# Altium project SuperCap_V1.1.PrjPcb
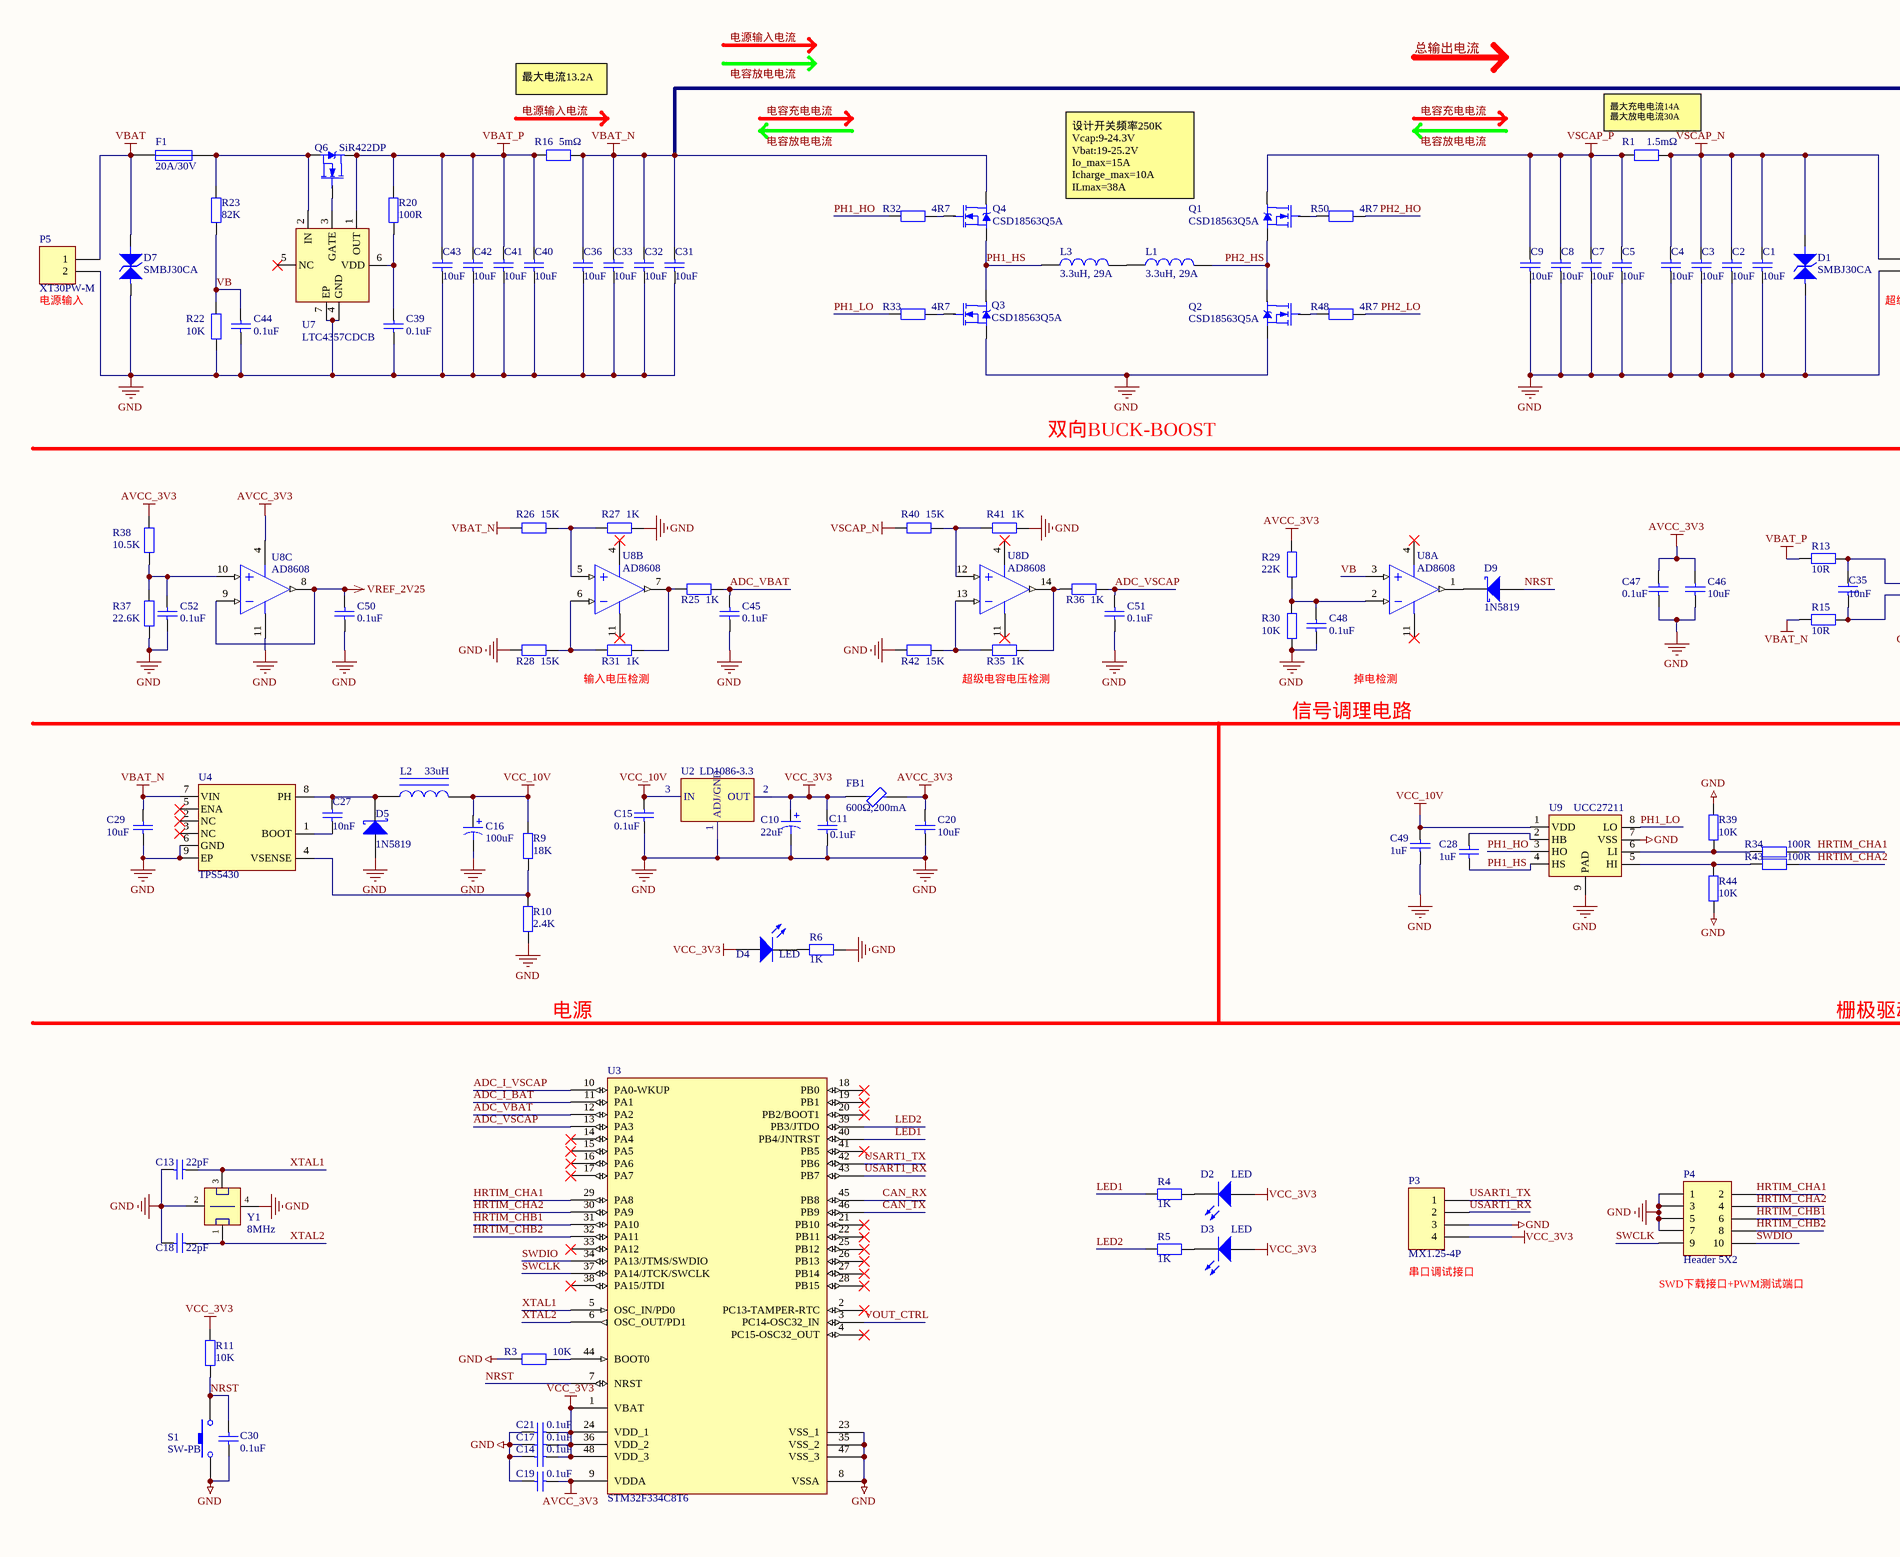
[diagram p0: SuperCap.SchDoc, left]
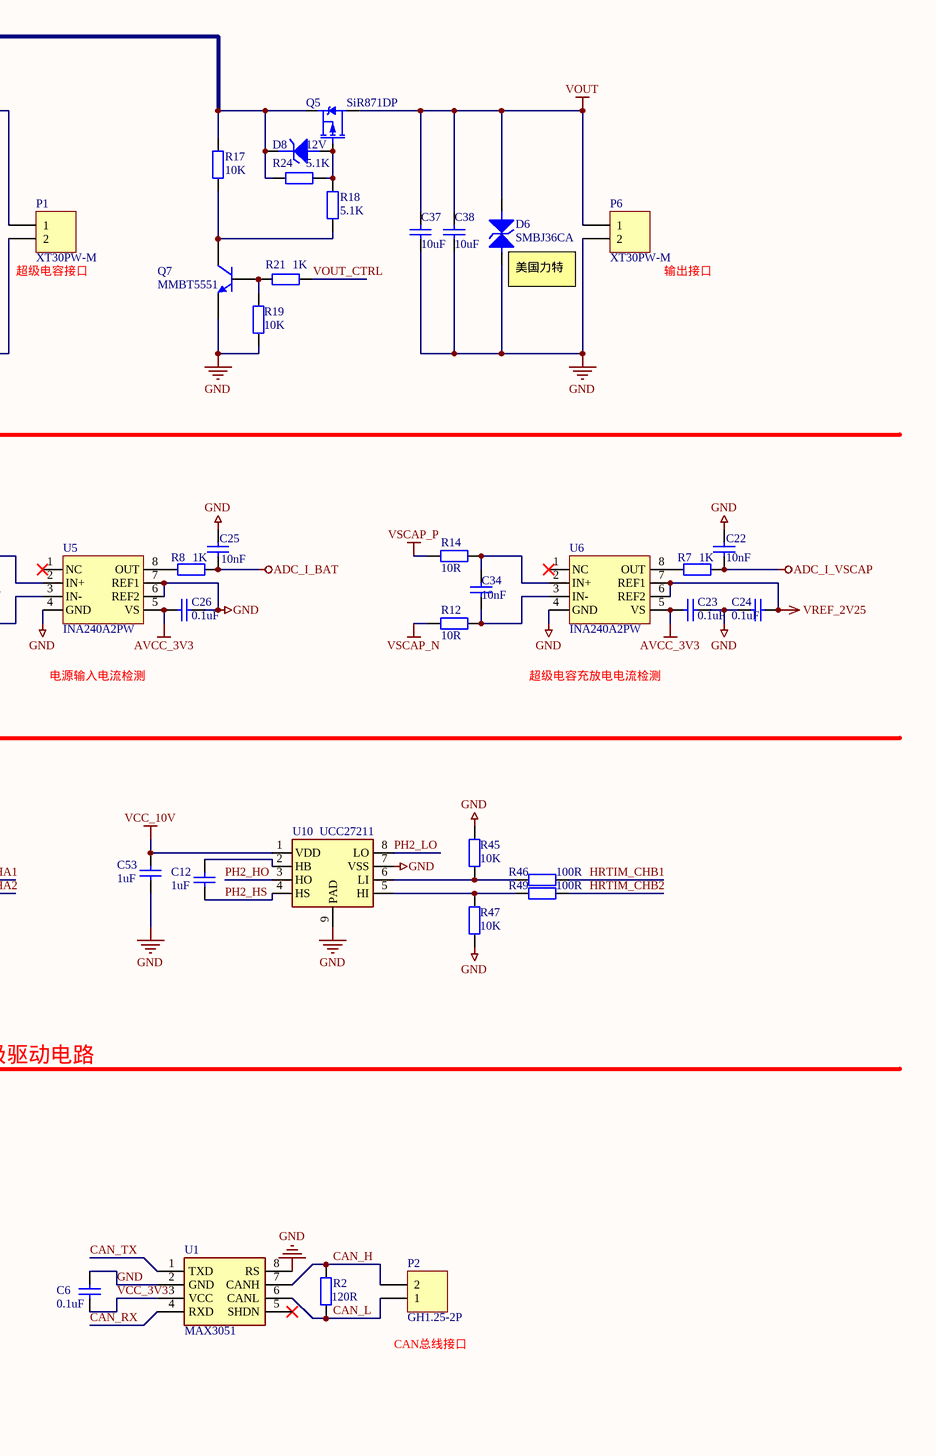
[diagram p1: SuperCap.SchDoc, right]
1 sheet, 142 parts. Net scope: global (net labels, ports and power ports of the same name join across sheets).
Board file: SuperCap.PcbDoc

## Sheet SuperCap.SchDoc
size A2

### Parts
C1  10uF  [C 0805_M]
C2  10uF  [C 0805_M]
C3  10uF  [C 0805_M]
C4  10uF  [C 0805_M]
C5  10uF  [C 0805_M]
C6  0.1uF  [C 0603_M]
C7  10uF  [C 0805_M]
C8  10uF  [C 0805_M]
C9  10uF  [C 0805_M]
C10  22uF  [CD B(3528)]
C11  0.1uF  [C 0603_M]
C12  1uF  [C 0603_M]
C13  22pF  [C 0603_M]
C14  0.1uF  [C 0603_M]
C15  0.1uF  [C 0603_M]
C16  100uF  [CD C(6032)]
C17  0.1uF  [C 0603_M]
C18  22pF  [C 0603_M]
C19  0.1uF  [C 0603_M]
C20  10uF  [C 0603_M]
C21  0.1uF  [C 0603_M]
C22  10nF  [C 0603_M]
C23  0.1uF  [C 0603_M]
C24  0.1uF  [C 0603_M]
C25  10nF  [C 0603_M]
C26  0.1uF  [C 0603_M]
C27  10nF  [C 0603_M]
C28  1uF  [C 0603_M]
C29  10uF  [C 0805_M]
C30  0.1uF  [C 0603_M]
C31  10uF  [C 0805_M]
C32  10uF  [C 0805_M]
C33  10uF  [C 0805_M]
C34  10nF  [C 0603_M]
C35  10nF  [C 0603_M]
C36  10uF  [C 0805_M]
C37  10uF  [C 0805_M]
C38  10uF  [C 0805_M]
C39  0.1uF  [C 0603_M]
C40  10uF  [C 0805_M]
C41  10uF  [C 0805_M]
C42  10uF  [C 0805_M]
C43  10uF  [C 0805_M]
C44  0.1uF  [C 0603_M]
C45  0.1uF  [C 0603_M]
C46  10uF  [C 0603_M]
C47  0.1uF  [C 0603_M]
C48  0.1uF  [C 0603_M]
C49  1uF  [C 0603_M]
C50  0.1uF  [C 0603_M]
C51  0.1uF  [C 0603_M]
C52  0.1uF  [C 0603_M]
C53  1uF  [C 0603_M]
D1  SMBJ30CA  [SMB]
D2  LED  [LED 0603R]
D3  LED  [LED 0603R]
D4  LED  [LED 0603R]
D5  1N5819  [SMA]
D6  SMBJ36CA  [SMB]
D7  SMBJ30CA  [SMB]
D8  12V  [SOD-123]
D9  1N5819  [SOD-323]
F1  20A/30V  [FU 1206]
FB1  600Ω,200mA  [FB0603_M]
L1  3.3uH, 29A  [WE-HCI_2212]
L2  33uH  [L-SMD-0630]
L3  3.3uH, 29A  [WE-HCI_2212]
P1  XT30PW-M  [XT30PW-M]
P2  GH1.25-2P  [A1257WR-S-2P]
P3  MX1.25-4P  [MX 1.25-WS-4P]
P4  Header 5X2  [HDR2.54-LI-2x5P]
P5  XT30PW-M  [XT30PW-M]
P6  XT30PW-M  [XT30PW-M]
Q1  CSD18563Q5A  [PG-TDSON-8]
Q2  CSD18563Q5A  [PG-TDSON-8]
Q3  CSD18563Q5A  [PG-TDSON-8]
Q4  CSD18563Q5A  [PG-TDSON-8]
Q5  SiR871DP  [PG-TDSON-8]
Q6  SiR422DP  [PG-TDSON-8]
Q7  MMBT5551  [SOT23-3N]
R1  1.5mΩ  [R 2512_M]
R2  120R  [R 0603_M]
R3  10K  [R 0603_M]
R4  1K  [R 0603_M]
R5  1K  [R 0603_M]
R6  1K  [R 0603_M]
R7  1K  [R 0603_M]
R8  1K  [R 0603_M]
R9  18K  [R 0603_M]
R10  2.4K  [R 0603_M]
R11  10K  [R 0603_M]
R12  10R  [R 0603_M]
R13  10R  [R 0603_M]
R14  10R  [R 0603_M]
R15  10R  [R 0603_M]
R16  5mΩ  [R 2512_M]
R17  10K  [R 0603_M]
R18  5.1K  [R 0603_M]
R19  10K  [R 0603_M]
R20  100R  [R 0603_M]
R21  1K  [R 0603_M]
R22  10K  [R 0603_M]
R23  82K  [R 0603_M]
R24  5.1K  [R 0603_M]
R25  1K  [R 0603_M]
R26  15K  [R 0603_M]
R27  1K  [R 0603_M]
R28  15K  [R 0603_M]
R29  22K  [R 0603_M]
R30  10K  [R 0603_M]
R31  1K  [R 0603_M]
R32  4R7  [R 0805_M]
R33  4R7  [R 0805_M]
R34  100R  [R 0603_M]
R35  1K  [R 0603_M]
R36  1K  [R 0603_M]
R37  22.6K  [R 0603_M]
R38  10.5K  [R 0603_M]
R39  10K  [R 0603_M]
R40  15K  [R 0603_M]
R41  1K  [R 0603_M]
R42  15K  [R 0603_M]
R43  100R  [R 0603_M]
R44  10K  [R 0603_M]
R45  10K  [R 0603_M]
R46  100R  [R 0603_M]
R47  10K  [R 0603_M]
R48  4R7  [R 0805_M]
R49  100R  [R 0603_M]
R50  4R7  [R 0805_M]
S1  SW-PB  [TS-1101]
U1  MAX3051  [SOT23-8N]
U2  LD1086-3.3  [TO252]
U3  STM32F334C8T6  [LQFP48 7X7_N]
U4  TPS5430  [SOIC-8-EP]
U5  INA240A2PW  [SSOP8]
U6  INA240A2PW  [SSOP8]
U7  LTC4357CDCB  [DFN-6_2x3_0.5]
U8  AD8608  [SOP14_N]  (parts A,B,C,D of 4)
U9  UCC27211  [SOIC-8-EP]
U10  UCC27211  [SOIC-8-EP]
Y1  8MHz  [OSC-3225-4P]

### Nets
ADC_I_BAT: C25.1 R8.2 U3.11(PA1)
ADC_I_VSCAP: C22.1 R7.2 U3.10(PA0-WKUP)
AVCC_3V3: C19.2 C20.2 C23.2 C26.2 C46.2 C47.2 FB1.2 R29.1 R38.1 U3.9(VDDA) U5.5(VS) U6.5(VS) U8.4(+V)
GND: C1.1 C2.1 C3.1 C4.1 C5.1 C6.2 C7.1 C8.1 C9.1 C10.2 C11.1 C13.1 C14.1 C15.2 C16.2 C17.1 C18.1 C19.1 C20.1 C21.1 C22.2 C23.1 C24.2 C25.2 C26.1 C29.1 C30.1 C31.1 C32.1 C33.1 C36.1 C37.1 C38.1 C39.1 C40.1 C41.1 C42.1 C43.1 C44.1 C45.1 C46.1 C47.1 C48.1 C49.1 C50.1 C51.1 C52.1 C53.1 D1.A D5.1(A) D6.A D7.A P1.2 P3.3 P4.1 P4.3 P4.5 P4.7 P5.2 P6.2 Q2.S Q3.S Q7.3(E) R3.1 R6.1 R10.2 R19.2 R22.1 R27.1 R28.1 R30.2 R37.2 R39.1 R41.1 R42.1 R44.2 R45.1 R47.2 S1.1 U1.2(GND) U1.8(RS) U2.1(ADJ/GND) U3.8(VSSA) U3.23(VSS_1) U3.35(VSS_2) U3.47(VSS_3) U4.6(GND) U4.9(EP) U5.4(GND) U5.6(REF2) U5.7(REF1) U6.4(GND) U7.4(GND) U7.7(EP) U8.11(-V) U9.7(VSS) U9.9(PAD) U10.7(VSS) U10.9(PAD) Y1.2 Y1.4
VBAT: D7.K F1.1 P5.1
VBAT_N: C29.2 C31.2 C32.2 C33.2 C36.2 D8.K Q4.D Q5.S R15.2 R16.2 R17.2 R24.2 R26.1 U4.7(VIN)
VBAT_P: C40.2 C41.2 C42.2 C43.2 Q6.D R13.2 R16.1 R20.2 U7.1(OUT)
VCC_3V3: C6.1 C10.1 C11.2 C14.2 C17.2 C21.2 D2.1(A) D3.1(A) D4.1(A) FB1.1 P3.4 R11.2 U1.3(VCC) U2.2(OUT) U3.1(VBAT) U3.24(VDD_1) U3.36(VDD_2) U3.48(VDD_3)
VCC_10V: C15.1 C16.1 C49.2 C53.2 L2.2 R9.1 U2.3(IN) U9.1(VDD) U10.1(VDD)
VOUT: C37.2 C38.2 D6.K P6.1 Q5.D
VREF_2V25: C24.1 C50.2 U6.6(REF2) U6.7(REF1) U8.8(OUT_C) U8.9(-IN_C)
VSCAP_N: C1.2 C2.2 C3.2 C4.2 D1.K P1.1 R1.1 R12.2 R40.1
VSCAP_P: C5.2 C7.2 C8.2 C9.2 Q1.D R1.2 R14.2
ADC_VBAT: C45.2 R25.2 U3.12(PA2)
ADC_VSCAP: C51.2 R36.2 U3.13(PA3)
CAN_H: P2.2 R2.1 U1.7(CANH)
CAN_L: P2.1 R2.2 U1.6(CANL)
CAN_RX: U1.4(RXD) U3.45(PB8)
CAN_TX: U1.1(TXD) U3.46(PB9)
HRTIM_CHA1: P4.2 R34.2 U3.29(PA8)
HRTIM_CHA2: P4.4 R43.2 U3.30(PA9)
HRTIM_CHB1: P4.6 R46.2 U3.31(PA10)
HRTIM_CHB2: P4.8 R49.2 U3.32(PA11)
LED1: R4.1 U3.40(PB4/JNTRST)
LED2: R5.1 U3.39(PB3/JTDO)
NRST: C30.2 D9.1(A) R11.1 S1.2 U3.7(NRST)
PH1_HO: R32.1 U9.3(HO)
PH1_HS: C28.1 L3.1 Q3.D Q4.S U9.4(HS)
PH1_LO: R33.1 U9.8(LO)
PH2_HO: R50.2 U10.3(HO)
PH2_HS: C12.1 L1.2 Q1.S Q2.D U10.4(HS)
PH2_LO: R48.2 U10.8(LO)
SWCLK: P4.9 U3.37(PA14/JTCK/SWCLK)
SWDIO: P4.10 U3.34(PA13/JTMS/SWDIO)
USART1_RX: P3.2 U3.43(PB7)
USART1_TX: P3.1 U3.42(PB6)
VB: C44.2 R22.2 R23.1 U8.3(+IN_A)
VOUT_CTRL: R21.1 U3.3(PC14-OSC32_IN)
XTAL1: C13.2 U3.5(OSC_IN/PD0) Y1.3
XTAL2: C18.2 U3.6(OSC_OUT/PD1) Y1.1
NetC12_2: C12.2 U10.2(HB)
NetC27_1: C27.1 U4.1(BOOT)
NetC27_2: C27.2 D5.2(K) L2.1 U4.8(PH)
NetC28_2: C28.2 U9.2(HB)
NetC34_1: C34.1 R12.1 U6.3(IN-)
NetC34_2: C34.2 R14.1 U6.2(IN+)
NetC35_1: C35.1 R15.1 U5.3(IN-)
NetC35_2: C35.2 R13.1 U5.2(IN+)
NetC39_2: C39.2 R20.1 U7.6(VDD)
NetC48_2: C48.2 R29.2 R30.1 U8.2(-IN_A)
NetC52_2: C52.2 R37.1 R38.2 U8.10(+IN_C)
NetD2_2: D2.2(K) R4.2
NetD3_2: D3.2(K) R5.2
NetD4_2: D4.2(K) R6.2
NetD8_A: D8.A Q5.G R18.2 R24.1
NetD9_2: D9.2(K) U8.1(OUT_A)
NetF1_2: F1.2 Q6.S R23.2 U7.2(IN)
NetL1_1: L1.1 L3.2
NetQ1_G: Q1.G R50.1
NetQ2_G: Q2.G R48.1
NetQ3_G: Q3.G R33.2
NetQ4_G: Q4.G R32.2
NetQ6_G: Q6.G U7.3(GATE)
NetQ7_1: Q7.1(C) R17.1 R18.1
NetQ7_2: Q7.2(B) R19.1 R21.2
NetR3_2: R3.2 U3.44(BOOT0)
NetR7_1: R7.1 U6.8(OUT)
NetR8_1: R8.1 U5.8(OUT)
NetR9_2: R9.2 R10.1 U4.4(VSENSE)
NetR25_1: R25.1 R31.2 U8.7(OUT_B)
NetR26_2: R26.2 R27.2 U8.5(+IN_B)
NetR28_2: R28.2 R31.1 U8.6(-IN_B)
NetR34_1: R34.1 R39.2 U9.6(LI)
NetR35_1: R35.1 R42.2 U8.13(-IN_D)
NetR35_2: R35.2 R36.1 U8.14(OUT_D)
NetR40_2: R40.2 R41.2 U8.12(+IN_D)
NetR43_1: R43.1 R44.1 U9.5(HI)
NetR45_2: R45.2 R46.1 U10.6(LI)
NetR47_1: R47.1 R49.1 U10.5(HI)

Not connected (* = marked no-connect by the designer): U1 5(SHDN)*; U3 2(PC13-TAMPER-RTC)* 4(PC15-OSC32_OUT)* 14(PA4)* 15(PA5)* 16(PA6)* 17(PA7)* 18(PB0)* 19(PB1)* 20(PB2/BOOT1)* 21(PB10)* 22(PB11)* 25(PB12)* 26(PB13)* 27(PB14)* 28(PB15)* 33(PA12)* 38(PA15/JTDI)* 41(PB5)*; U4 2(NC)* 3(NC)* 5(ENA)*; U5 1(NC)*; U6 1(NC)*; U7 5(NC)*

### Notes on the sheet
- 电源输入电流
- 总输出电流
- 最大电流13.2A
- (near R16) 电源输入电流
- 电容放电电流
- 电容充电电流
- (near R1) 最大充电电流14A
  最大放电电流30A
- 设计开关频率250K
  Vcap:9-24.3V
  Vbat:19-25.2V
  Io_max=15A
  Icharge_max=10A
  ILmax=38A
- (near P5) 电源输入
- (near P1) 超级电容接口
- (near D6) 美国力特
- (near P6) 输出接口
- 双向BUCK-BOOST
- (near R31) 输入电压检测
- 超级电容电压检测
- 掉电检测
- 电源输入电流检测
- 超级电容充放电电流检测
- 信号调理电路
- 电源
- 栅极驱动电路
- (near P3) 串口调试接口
- (near P4) SWD下载接口+PWM测试端口
- (near P2) CAN总线接口

### Library data of the parts
C1-C9 C11-C15 C17-C21 C27-C33 C36-C53 = Cap: Capacitor
  C13 C18: Published: 8-Jun-2000; LatestRevisionDate: 17-Jul-2002; LatestRevisionNote: Re-released for DXP Platform.; PackageReference: RAD-0.3; Publisher: Altium Limited; PackageDescription: Radial Cap, Thru-Hole; 2 Leads; 0.3 in Pin Spacing; Value: 22pF
C10 C16 = Cap Pol1: Polarized Capacitor (Radial)
C22 C25 = Cap: Capacitor; Value: 0.1uF; Published: 8-Jun-2000; LatestRevisionDate: 17-Jul-2002; LatestRevisionNote: Re-released for DXP Platform.; PackageReference: RAD-0.3; Publisher: Altium Limited; PackageDescription: Radial Cap, Thru-Hole; 2 Leads; 0.3 in Pin Spacing
C23 C24 C26 = Cap: Capacitor; Value: 104; Published: 8-Jun-2000; LatestRevisionDate: 17-Jul-2002; LatestRevisionNote: Re-released for DXP Platform.; PackageReference: RAD-0.3; Publisher: Altium Limited; PackageDescription: Radial Cap, Thru-Hole; 2 Leads; 0.3 in Pin Spacing
C34 C35 = Cap: Capacitor; Value: 100pF; Published: 8-Jun-2000; LatestRevisionDate: 17-Jul-2002; LatestRevisionNote: Re-released for DXP Platform.; PackageReference: RAD-0.3; Publisher: Altium Limited; PackageDescription: Radial Cap, Thru-Hole; 2 Leads; 0.3 in Pin Spacing
D1 D6 D7 = TVS: 双向瞬态抑制二极管; pin to pad: A>1 K>2
D2-D4 = LED0: Typical INFRARED GaAs LED
D5 = Diode 11DQ03: Schottky Rectifier; pin to pad: A>1 K>2; ComponentLink1Description: Manufacturer Link; ComponentLink1URL: http://www.irf.com/; ComponentLink2Description: Datasheet; ComponentLink2URL: http://www.irf.com/product-info/datasheets/data/11dq03.pdf
D8 = DIODE ZENER: 稳压二极管; pin to pad: A>1 K>2
D9 = D Schottky: Schottky Diode; Published: 8-Jun-2000; LatestRevisionDate: 17-Jul-2002; LatestRevisionNote: Re-released for DXP Platform.; PackageReference: SMB; Publisher: Altium Limited; PackageDescription: DO-214-AA/SMB; 2 C-Bend Leads; Body 5.3 x 3.6 mm, inc. leads (LxW); Code_JEDEC: DO-214-AA
F1 = Fuse 1: Fuse; Published: 8-Jun-2000; LatestRevisionDate: 17-Jul-2002; LatestRevisionNote: Re-released for DXP Platform.; PackageReference: PIN-W2/E2.8; Publisher: Altium Limited; PackageDescription: Thru-Hole; 2 Leads
FB1 = Ferrite Bead
L1 L3 = 74435580330: WE-HCI SMT Flat Wire High Current Inductor, size 2212, 3.3uH, 29A; Manufacturer: Wurth Elektronik; DC Resistance: 1.7mOhm; Material: MnZn; Self Resonant Frequency: 26.5MHz; Saturation Current: 45A; Rated Inductance: 2.85uH; ComponentLink1Description: Manufacturer; ComponentLink1URL: http://www.we-online.de; ComponentLink2Description: Datasheet; ComponentLink2URL: https://www.we-online.com/catalog/datasheet/74435580330.pdf; Operating Temperature: -40 to +125degC; Packaging: Tape and Reel; Published Date: April 2020; Rated Current: 29A; Size: 2212; Inductance: 3.3uH; Manufacturer Part Number: 74435580330; Mounting Technology: SMT
L2 = Inductor Iron: Magnetic-Core Inductor
P1 P5 P6 = Header 2: Header, 2-Pin; pin to pad: 1>+ 2>-; LatestRevisionDate: 17-Jul-2002; LatestRevisionNote: Re-released for DXP Platform.; Publisher: Altium Limited
P2 = Header 2: Header, 2-Pin; LatestRevisionDate: 17-Jul-2002; LatestRevisionNote: Re-released for DXP Platform.; Publisher: Altium Limited
P3 = Header 4: Header, 4-Pin; LatestRevisionDate: 17-Jul-2002; LatestRevisionNote: Re-released for DXP Platform.; Publisher: Altium Limited
P4 = Header 5X2: Header, 5-Pin, Dual row; LatestRevisionDate: 17-Jul-2002; LatestRevisionNote: Re-released for DXP Platform.; Publisher: Altium Limited
Q1-Q4 Q6 = N-MOS: N沟道场效应管
Q5 = P-MOS: P沟道场效应管
Q7 = NPN: NPN Bipolar Transistor; pin to pad: 1>3 2>1 3>2; Published: 8-Jun-2000; LatestRevisionDate: 17-Jul-2002; LatestRevisionNote: Re-released for DXP Platform.; PackageReference: TO-226-AA; Publisher: Altium Limited; PackageDescription: TO, Flat Index; 3 In-Line, Axial Leads; Body Dia. 4.8mm; Leads 0.55 x 0.51 mm (max); Code_JEDEC: TO-226-AA
R1 R16 = Res2: Resistor; Value: 15mΩ; Published: 8-Jun-2000; LatestRevisionDate: 17-Jul-2002; LatestRevisionNote: Re-released for DXP Platform.; PackageReference: AXIAL-0.4; Publisher: Altium Limited; PackageDescription: Axial Device, Thru-Hole; 2 Leads; 0.4 in Pin Spacing
R2-R6 R9-R11 R17-R50 = Res2: Resistor
R7 R8 = Res2: Resistor; Value: 2K; Published: 8-Jun-2000; LatestRevisionDate: 17-Jul-2002; LatestRevisionNote: Re-released for DXP Platform.; PackageReference: AXIAL-0.4; Publisher: Altium Limited; PackageDescription: Axial Device, Thru-Hole; 2 Leads; 0.4 in Pin Spacing
R12-R15 = Res2: Resistor; Value: 1K; Published: 8-Jun-2000; LatestRevisionDate: 17-Jul-2002; LatestRevisionNote: Re-released for DXP Platform.; PackageReference: AXIAL-0.4; Publisher: Altium Limited; PackageDescription: Axial Device, Thru-Hole; 2 Leads; 0.4 in Pin Spacing
S1 = SW-PB: Switch; Published: 24-Mar-1999; LatestRevisionDate: 17-Jul-2002; LatestRevisionNote: Re-released for DXP Platform.; PackageReference: SPST-2; Publisher: Altium Limited; PackageDescription: Switch; 2 Leads
U2 = AMS1086
U3 = STM32F103C8T6
U5 U6 = INA240 PW
U8 = AD8608ARZ-REEL7: Quad Channel Wide Bandwidth Operational Amplifier, 10 MHz BW, 5 V/us SR, Industrial, 14-pin SOIC (R-14), Reel; Manufacturer: Analog Devices; Amplifiers Per Package: 4; Input Bias Current: 200fA; Input Offset Voltage: 20uV; Iq/Amp: 1.2mA; Slew Rate: 5V/us; Small Signal Bandwidth: 10MHz; V Span Max: 6V; V Span Min: 2.7V; DatasheetVersion: Rev. L; PackageVersion: 060606-A; PackageReference: R-14; PackageDescription: 14-Pin Standard Small Outline Package, Body 8.65 x 3.9 mm, Pitch 1.27 mm; Supplier 1: Digi-Key; Supplier Part Number 1: AD8608ARZ-REEL7-ND; Supplier 2: Newark; Supplier Part Number 2: 59K6933; Generic Part Number: AD8608; Mounting Technology: Surface Mount; Code_JEDEC: MS-012-AB; PartNumber: AD8608ARZ-REEL7; ComponentLink1Description: Manufacturer URL; ComponentLink1URL: http://www.analog.com/en/index.html; ComponentLink2Description: Datasheet; ComponentLink2URL: http://www.analog.com/static/imported-files/data_sheets/AD8605_8606_8608.pdf; ComponentLink3Description: Package Specification; ComponentLink3URL: http://www.analog.com/static/imported-files/packages/PKG_PDF/SOIC_Narrow%20(R)/R_14.pdf; ComponentLink4Description: Reference Circuit; ComponentLink4URL: http://www.analog.com/en/all-operational-amplifiers-op-amps/operational-amplifiers-op-amps/ad8608/products/product.html#product-recommendations
Y1 = XTAL: Value: 16M